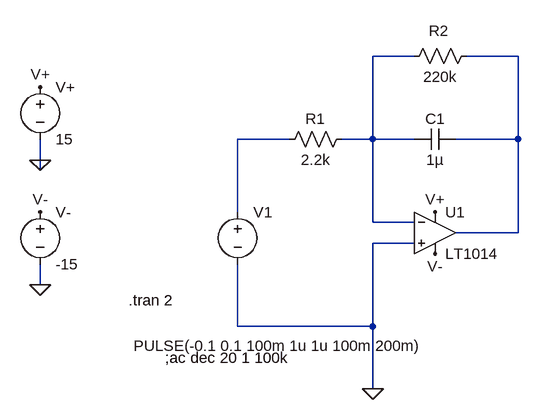
[diagram p0: schematic aufgabe3_integrierer.asc]
aufgabe3_integrierer.asc, the LTspice schematic file:
Version 4
SHEET 1 1008 680
WIRE 240 -144 176 -144
WIRE 400 -144 320 -144
WIRE 48 -16 -32 -16
WIRE 176 -16 176 -144
WIRE 176 -16 128 -16
WIRE 240 -16 176 -16
WIRE 400 -16 400 -144
WIRE 400 -16 304 -16
WIRE -336 16 -336 -16
WIRE -336 32 -336 16
WIRE -32 96 -32 -16
WIRE 176 112 176 -16
WIRE 240 112 176 112
WIRE 400 128 400 -16
WIRE 400 128 304 128
WIRE 240 144 176 144
WIRE -336 208 -336 176
WIRE -32 272 -32 176
WIRE 176 272 176 144
WIRE 176 272 -32 272
WIRE 176 368 176 272
FLAG 176 368 0
FLAG -336 208 0
FLAG -336 16 0
FLAG -336 -96 V+
FLAG -336 96 V-
FLAG 272 160 V-
FLAG 272 96 V+
SYMBOL Opamps\\LT1014 272 64 R0
SYMATTR InstName U1
SYMBOL voltage -32 80 R0
WINDOW 3 -160 222 Left 2
WINDOW 123 -160 194 Left 2
WINDOW 39 0 0 Left 2
SYMATTR InstName V1
SYMATTR Value PULSE(-0.1 0.1 100m 1u 1u 100m 200m)
SYMBOL res 144 -32 R90
WINDOW 0 0 56 VBottom 2
WINDOW 3 32 56 VTop 2
SYMATTR InstName R1
SYMATTR Value 2.2k
SYMBOL res 336 -160 R90
WINDOW 0 -7 58 VBottom 2
WINDOW 3 32 56 VTop 2
SYMATTR InstName R2
SYMATTR Value 220k
SYMBOL cap 304 -32 R90
WINDOW 0 0 32 VBottom 2
WINDOW 3 32 32 VTop 2
SYMATTR InstName C1
SYMATTR Value 1µ
SYMBOL voltage -336 80 R0
WINDOW 123 0 0 Left 2
WINDOW 39 0 0 Left 2
SYMATTR InstName V-
SYMATTR Value -15
SYMBOL voltage -336 -112 R0
WINDOW 123 0 0 Left 2
WINDOW 39 0 0 Left 2
SYMATTR InstName V+
SYMATTR Value 15
TEXT -200 232 Left 2 !.tran 2
TEXT -144 320 Left 2 !;ac dec 20 1 100k

The netlist it stands for:
* aufgabe3_integrierer.asc
XU1 0 N001 V+ V- N002 LT1014  ; pins In+ In- V+ V- OUT
V1 N003 0 PULSE(-0.1 0.1 100m 1u 1u 100m 200m)
R1 N001 N003 2.2k
R2 N002 N001 220k
C1 N002 N001 1µ
V- V- 0 -15
V+ V+ 0 15
.tran 2
;ac dec 20 1 100k
.backanno
.end